# Altium schematic sheet IDCI_WifiNode_CPU1.SchDoc: WifiNode_CPU1
size A4; Author: Luciano Lopez; CompanyName: UTN-FRBA; Revision: 1; SheetNumber: 4; SheetTotal: 5
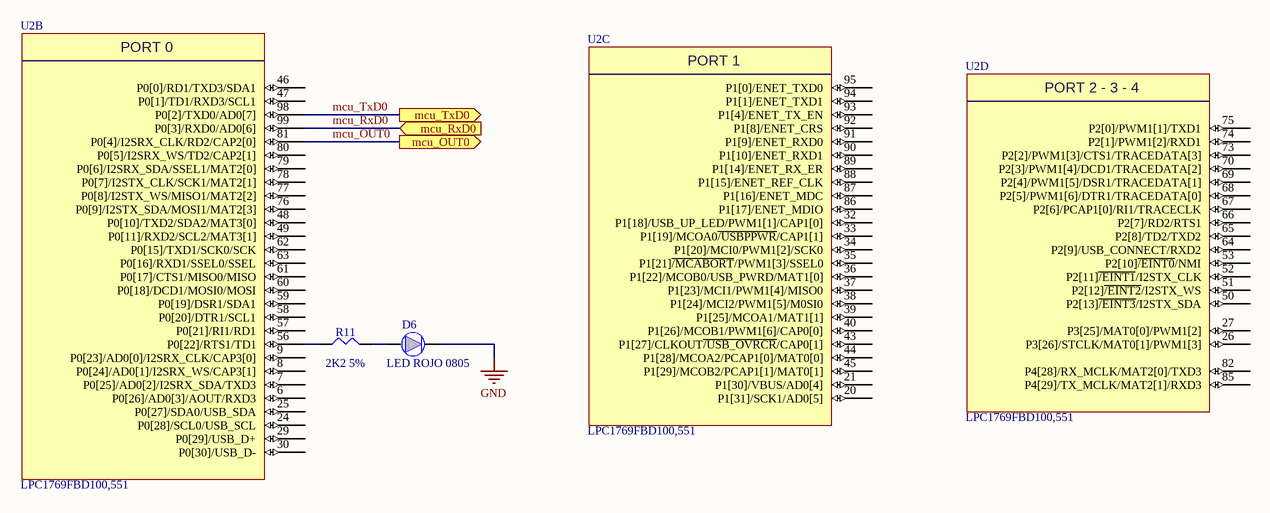
[diagram p0: IDCI_WifiNode_CPU1.SchDoc]

## Parts
D6  LED ROJO 0805  [LED_0805]
R11  2K2 5%  [R_0805]
U2  LPC1769FBD100,551  [LQFP_100]  (parts B,C,D of 4)

## Ports
mcu_OUT0 (out), mcu_RxD0 (in), mcu_TxD0 (out)

## Nets
GND: D6.2
mcu_OUT0: U2.81(P0[4]/I2SRX_CLK/RD2/CAP2[0]) ; port mcu_OUT0
mcu_RxD0: U2.99(P0[3]/RXD0/AD0[6]) ; port mcu_RxD0
mcu_TxD0: U2.98(P0[2]/TXD0/AD0[7]) ; port mcu_TxD0
NetD6_1: D6.1 R11.2
NetR11_1: R11.1 U2.56(P0[22]/RTS1/TD1)

Not connected (* = marked no-connect by the designer): U2 6(P0[26]/AD0[3]/AOUT/RXD3) 7(P0[25]/AD0[2]/I2SRX_SDA/TXD3) 8(P0[24]/AD0[1]/I2SRX_WS/CAP3[1]) 9(P0[23]/AD0[0]/I2SRX_CLK/CAP3[0]) 20(P1[31]/SCK1/AD0[5]) 21(P1[30]/VBUS/AD0[4]) 24(P0[28]/SCL0/USB_SCL) 25(P0[27]/SDA0/USB_SDA) 26(P3[26]/STCLK/MAT0[1]/PWM1[3]) 27(P3[25]/MAT0[0]/PWM1[2]) 29(P0[29]/USB_D+) 30(P0[30]/USB_D-) 32(P1[18]/USB_UP_LED/PWM1[1]/CAP1[0]) 33(P1[19]/MCOA0~{/USBPPWR}/CAP1[1]) 34(P1[20]/MCI0/PWM1[2]/SCK0) 35(P1[21]~{/MCABORT}/PWM1[3]/SSEL0) 36(P1[22]/MCOB0/USB_PWRD/MAT1[0]) 37(P1[23]/MCI1/PWM1[4]/MISO0) 38(P1[24]/MCI2/PWM1[5]/M0SI0) 39(P1[25]/MCOA1/MAT1[1]) 40(P1[26]/MCOB1/PWM1[6]/CAP0[0]) 43(P1[27]/CLKOUT~{/USB_OVRCR}/CAP0[1]) 44(P1[28]/MCOA2/PCAP1[0]/MAT0[0]) 45(P1[29]/MCOB2/PCAP1[1]/MAT0[1]) 46(P0[0]/RD1/TXD3/SDA1) 47(P0[1]/TD1/RXD3/SCL1) 48(P0[10]/TXD2/SDA2/MAT3[0]) 49(P0[11]/RXD2/SCL2/MAT3[1]) 50(P2[13]~{/EINT3}/I2STX_SDA) 51(P2[12]~{/EINT2}/I2STX_WS) 52(P2[11]~{/EINT1}/I2STX_CLK) 53(P2[10]~{/EINT0}/NMI) 57(P0[21]/RI1/RD1) 58(P0[20]/DTR1/SCL1) 59(P0[19]/DSR1/SDA1) 60(P0[18]/DCD1/MOSI0/MOSI) 61(P0[17]/CTS1/MISO0/MISO) 62(P0[15]/TXD1/SCK0/SCK) 63(P0[16]/RXD1/SSEL0/SSEL) 64(P2[9]/USB_CONNECT/RXD2) 65(P2[8]/TD2/TXD2) 66(P2[7]/RD2/RTS1) 67(P2[6]/PCAP1[0]/RI1/TRACECLK) 68(P2[5]/PWM1[6]/DTR1/TRACEDATA[0]) 69(P2[4]/PWM1[5]/DSR1/TRACEDATA[1]) 70(P2[3]/PWM1[4]/DCD1/TRACEDATA[2]) 73(P2[2]/PWM1[3]/CTS1/TRACEDATA[3]) 74(P2[1]/PWM1[2]/RXD1) 75(P2[0]/PWM1[1]/TXD1) 76(P0[9]/I2STX_SDA/MOSI1/MAT2[3]) 77(P0[8]/I2STX_WS/MISO1/MAT2[2]) 78(P0[7]/I2STX_CLK/SCK1/MAT2[1]) 79(P0[6]/I2SRX_SDA/SSEL1/MAT2[0]) 80(P0[5]/I2SRX_WS/TD2/CAP2[1]) 82(P4[28]/RX_MCLK/MAT2[0]/TXD3) 85(P4[29]/TX_MCLK/MAT2[1]/RXD3) 86(P1[17]/ENET_MDIO) 87(P1[16]/ENET_MDC) 88(P1[15]/ENET_REF_CLK) 89(P1[14]/ENET_RX_ER) 90(P1[10]/ENET_RXD1) 91(P1[9]/ENET_RXD0) 92(P1[8]/ENET_CRS) 93(P1[4]/ENET_TX_EN) 94(P1[1]/ENET_TXD1) 95(P1[0]/ENET_TXD0)

## Notes on the sheet
- Title:
- Size:
- Author:
- A4
- Sheet
- of
- Revision:
- File:
- Date:
- (in symbol LPC1769FBD100_Multipart, part B) PORT 0
- (in symbol LPC1769FBD100_Multipart, part C) PORT 1
- (in symbol LPC1769FBD100_Multipart, part D) PORT 2 - 3 - 4

## Library data of the parts
D6 = LED_DIODE
R11 = Resistor
U2 = LPC1769FBD100_Multipart: Mcu Cortex M3 LQFP100